# EAGLE design XephConnect_v0.1 (EAGLE 9.3.2)
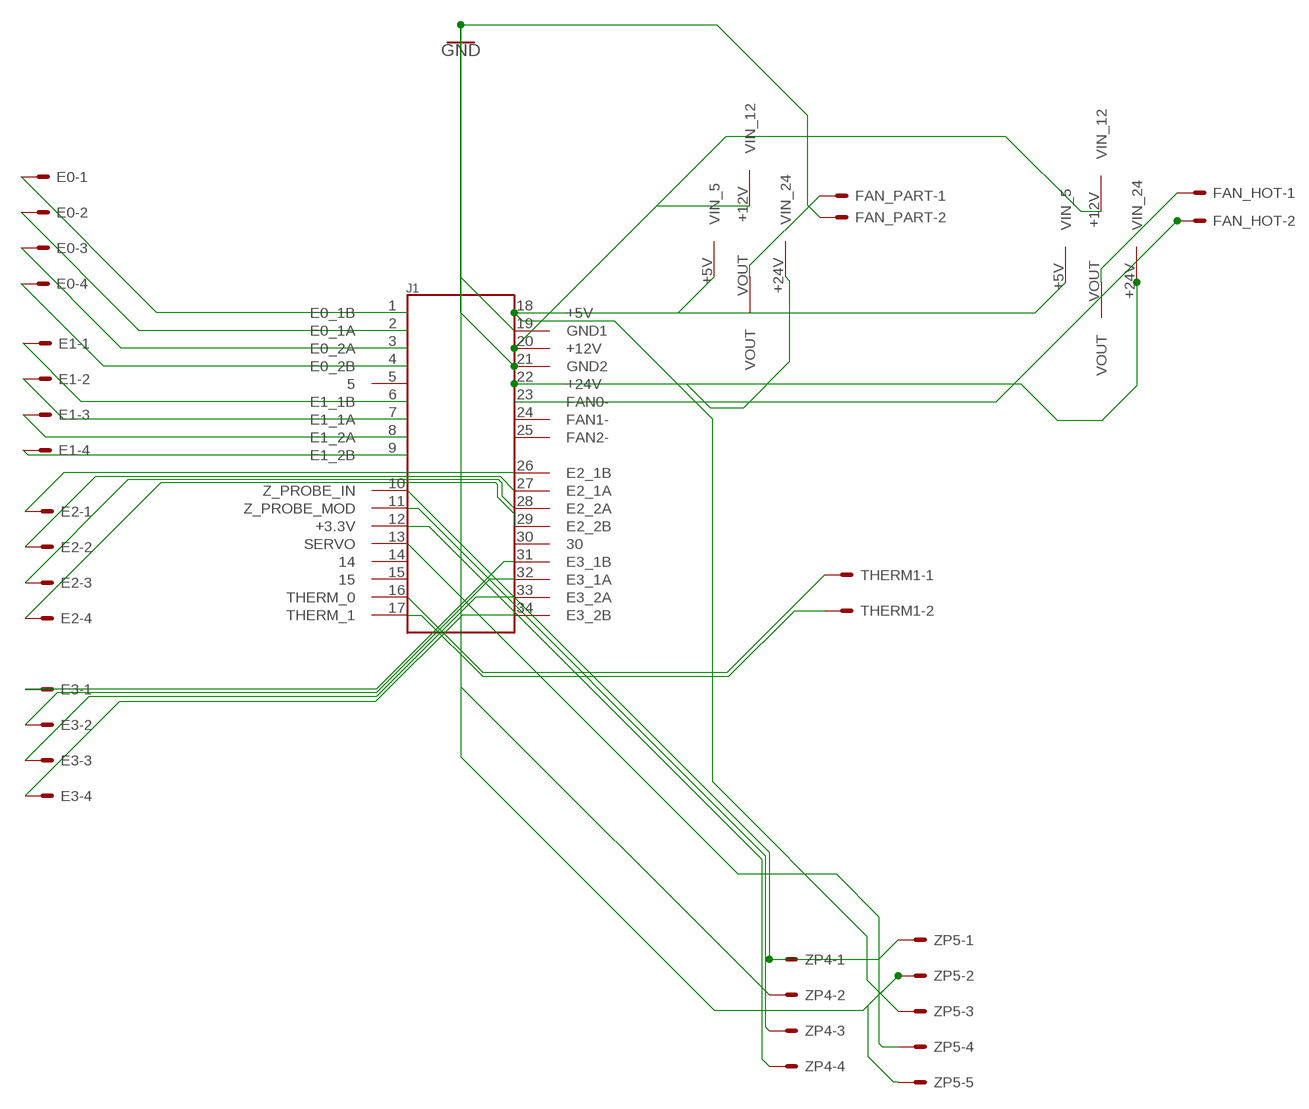
[diagram p0: schematic, sheet 1]

## Parts
E0  22-27-2041-04  [6410-04]
E1  22-27-2041-04  [6410-04]
E2  22-27-2041-04  [6410-04]
E3  22-27-2041-04  [6410-04]
FAN_HOT  22-27-2021-02  [6410-02]
FAN_PART  22-27-2021-02  [6410-02]
J1  6437288-1  [TE_6437288-1]
THERM1  22-27-2021-02  [6410-02]
U$1  CONN_03+01(T)  [1X03X01]
U$2  CONN_03+01(T)  [1X03X01]
ZP4  22-27-2041-04  [6410-04]
ZP5  22-27-2051-05  [6410-05]

## Nets
GND [ground]: FAN_PART.2 J1.19(GND1) J1.21(GND2) ZP4.2 ZP5.2 ZP5.5
N$1 [steppers]: E0.1 J1.1(E0_1B)
N$2 [steppers]: E0.2 J1.2(E0_1A)
N$3 [steppers]: E0.3 J1.3(E0_2A)
N$4 [steppers]: E0.4 J1.4(E0_2B)
N$5: J1.10(Z_PROBE_IN) ZP4.1 ZP5.1
N$6 [steppers]: E1.1 J1.6(E1_1B)
N$7 [steppers]: E1.2 J1.7(E1_1A)
N$8 [steppers]: E1.3 J1.8(E1_2A)
N$9 [steppers]: E1.4 J1.9(E1_2B)
N$10 [steppers]: E2.1 J1.26(E2_1B)
N$11 [steppers]: E2.2 J1.27(E2_1A)
N$12 [steppers]: E2.3 J1.28(E2_2A)
N$13 [steppers]: E2.4 J1.29(E2_2B)
N$14 [steppers]: E3.1 J1.31(E3_1B)
N$15 [steppers]: E3.2 J1.32(E3_1A)
N$16 [steppers]: E3.3 J1.33(E3_2A)
N$17 [steppers]: E3.4 J1.34(E3_2B)
N$18: J1.16(THERM_0) THERM1.1
N$19: J1.17(THERM_1) THERM1.2
N$20 [5v]: J1.18(+5V) U$1.+5V(VIN_5) U$2.+5V(VIN_5) ZP5.3
N$21 [12v]: J1.20(+12V) U$1.+12V(VIN_12) U$2.+12V(VIN_12)
N$22 [24v]: FAN_HOT.2 J1.23(FAN0-)
N$23 [24v]: J1.22(+24V) U$1.+24V(VIN_24) U$2.+24V(VIN_24)
N$24 [24v]: FAN_PART.1 U$1.VOUT
N$25 [24v]: FAN_HOT.1 U$2.VOUT
N$26: J1.11(Z_PROBE_MOD) ZP4.3
N$27 [3.3v]: J1.12(+3.3V) ZP4.4
N$28 [steppers]: J1.13(SERVO) ZP5.4
Unconnected: J1.5 J1.14 J1.15 J1.30

## Power pins joined to a net without a drawn wire
FAN1-: J1.24(FAN1-)
FAN2-: J1.25(FAN2-)

## Library data of the parts
E0 E1-E3 ZP4 = con-molex_EDITED:22-?-04: CONNECTOR wire to board 2.54 mm (.1 inch) pitch header; MF: MOLEX; OC_FARNELL: unknown; OC_NEWARK: unknown
FAN_HOT FAN_PART THERM1 = con-molex_EDITED:22-?-02: CONNECTOR wire to board 2.54 mm (.1 inch) pitch header; MF: MOLEX; OC_FARNELL: unknown; OC_NEWARK: unknown
J1 = 6437288-1:6437288-1: 34 Position 4 Row Right Angle Receptacle Through Hole Super Seal Cap Assy; COMMENT: 6437288-1; DESCRIPTION: 34 Position 4 Row Right Angle Receptacle Through Hole Super Seal Cap Assy; DIGI-KEY_PART_NUMBER: A124384-ND; DIGI-KEY_PURCHASE_URL: https://www.digikey.com/product-detail/en/te-connectivity-amp-connectors/6437288-1/A124384-ND/5428601?utm_source=snapeda&utm_medium=aggregator&utm_campaign=symbol; EU_ROHS_COMPLIANCE: Compliant; MF: TE Connectivity; MP: 6437288-1; PACKAGE: None; TE_PURCHASE_URL: https://www.te.com/usa-en/product-6437288-1.html?te_bu=Cor&te_type=disp&te_campaign=seda_glo_cor-seda-global-disp-prtnr-fy19-seda-model-bom-cta_sma-317_1&elqCampaignId=32493
U$1 U$2 = Xeph 3D Printing:CONN_03+01(T)
ZP5 = con-molex_EDITED:22-?-05: CONNECTOR wire to board 2.54 mm (.1 inch) pitch header; MF: MOLEX; OC_FARNELL: unknown; OC_NEWARK: unknown

## Net classes
1 steppers: width 0.4 mm, drill 0.4 mm
2 3.3v: width 0.4 mm, drill 0.4 mm, clearance 0.05 mm
3 5v: width 0.5 mm, drill 0.5 mm, clearance 0.06 mm
4 12v: width 0.6 mm, drill 0.6 mm, clearance 0.07 mm
5 24v: width 0.7 mm, drill 0.7 mm, clearance 0.08 mm
6 ground: width 0.7 mm, drill 0.7 mm

## Board
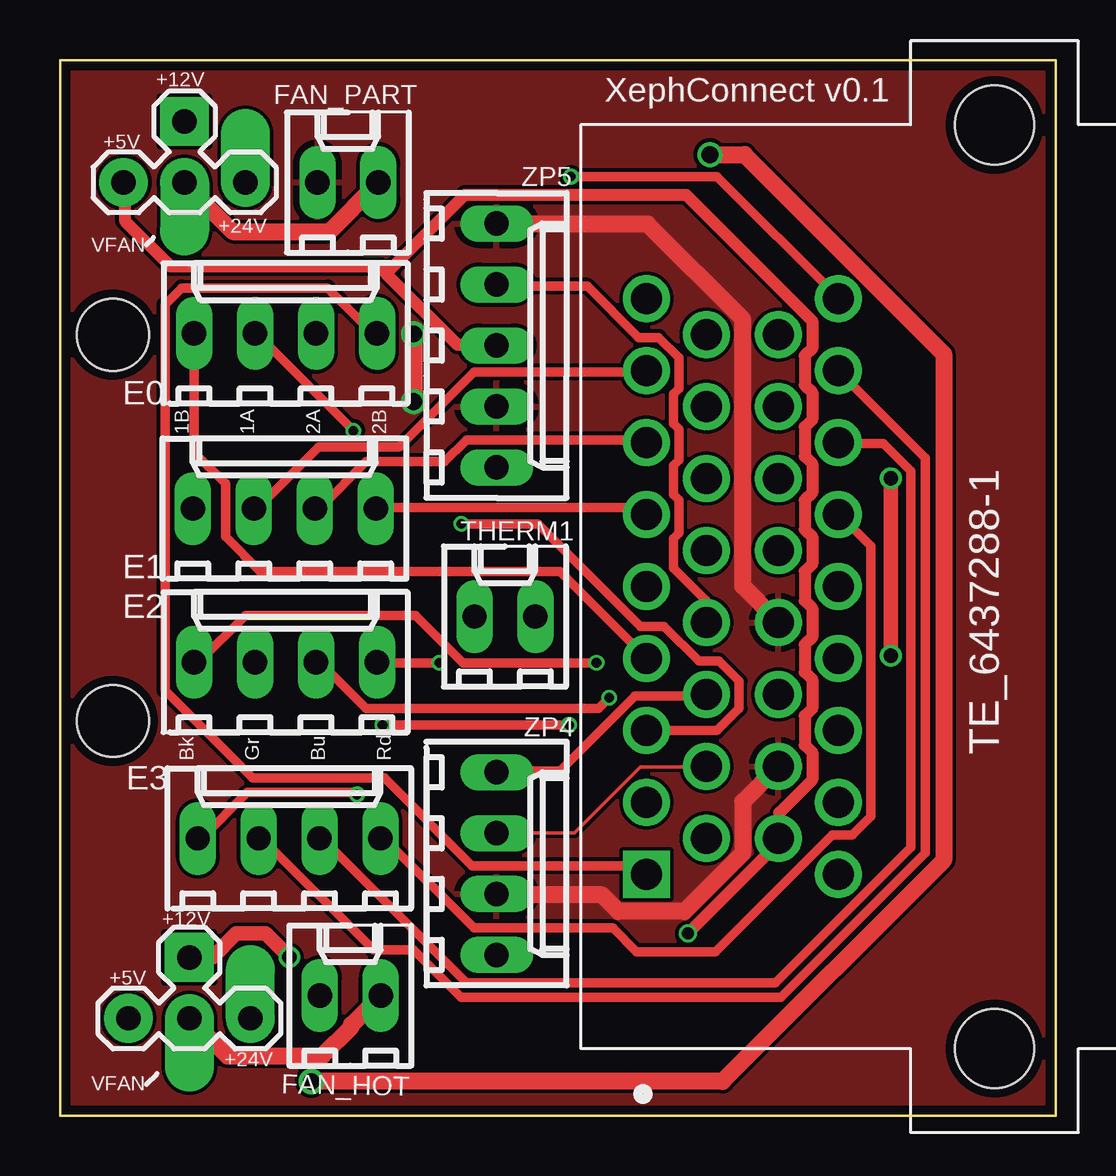
[diagram p1: board, top side]
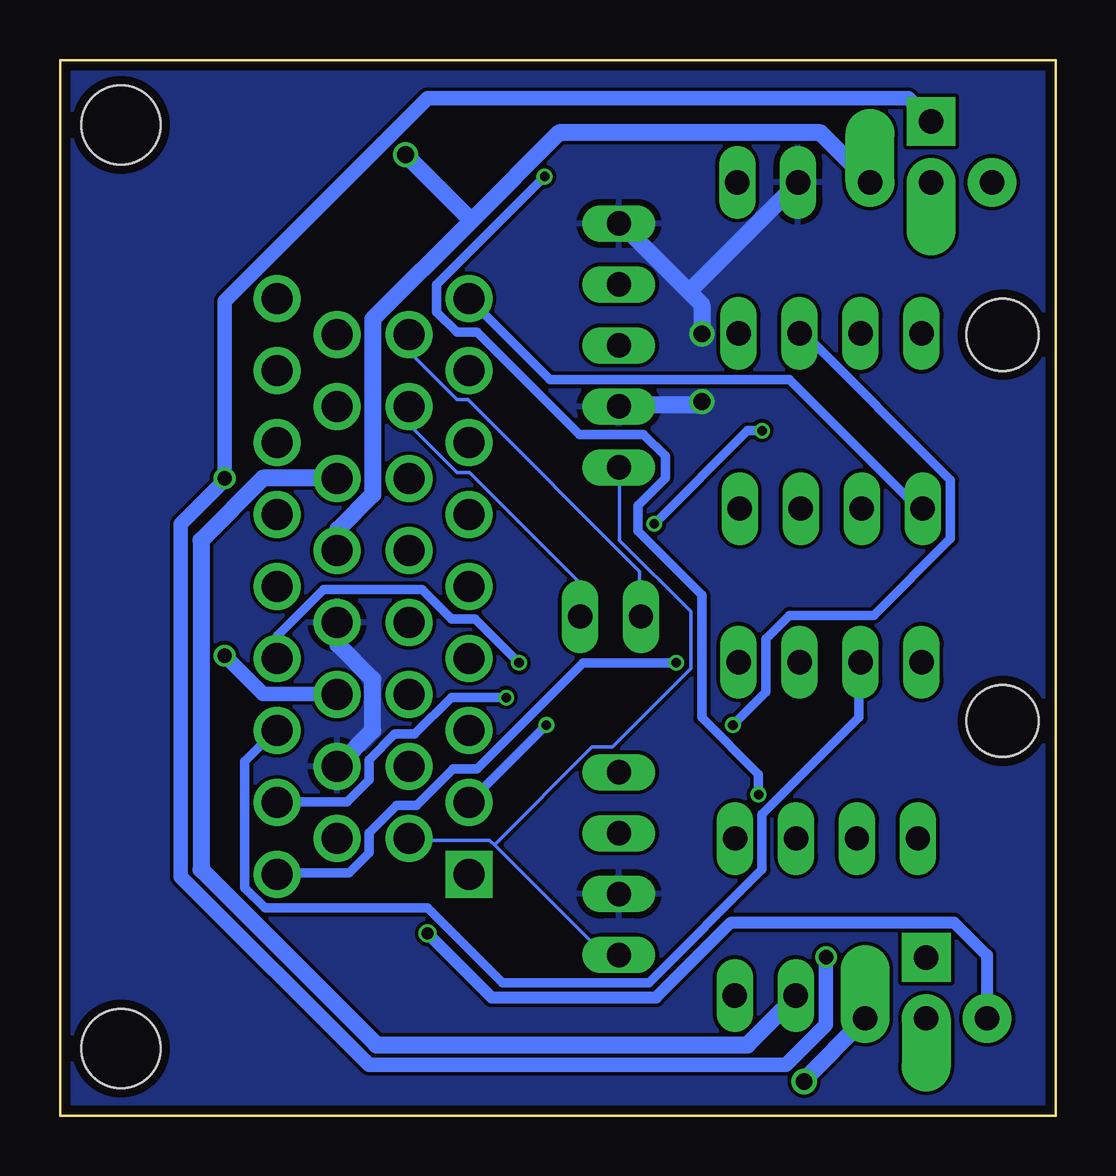
[diagram p2: board, bottom side, seen from below]

Size 41.5 x 44 mm. Coordinates in mm from the lower left corner, seen from the top.
Outline: 0,0 41.5,0 41.5,44 0,44 0,0
Copper layers (1*16): Top 0.035559375mm / dielectric 1.6mm / Bottom 0.035559375mm
Design rules "oshpark-2layer *": minimum track width 6mil, minimum drill 10mil, track to track 6mil, track to pad 6mil, pad to pad 6mil, via to via 6mil, smd to smd 6mil, copper to edge 15mil, drill to drill 6mil, minimum pad ring 5mil, minimum via ring 5mil, stop-mask expansion 2.5mil, vias tented up to drill 1mm, thermal gap 10mil
Holes 3 mm at 2.2,32.55 2.2,16.45

### Footprints (pad centres in the part's own frame; a part is rotated, then mirrored left to right if it is on the bottom)
6410-04 = drill 1.016 long: 1 3.81,0; 2 1.27,0; 3 -1.27,0; 4 -3.81,0
6410-02 = drill 1.016 long: 1 1.27,0; 2 -1.27,0
TE_6437288-1 = drill 1.3 square: 1 -12,4 | drill 1.3: 2 -9,4; 3 -6,4; 4 -3,4; 5 0,4; 6 3,4; 7 6,4; 8 9,4; 9 12,4; 10 -10.5,1.5; 11 -7.5,1.5; 12 -4.5,1.5; 13 -1.5,1.5; 14 1.5,1.5; 15 4.5,1.5; 16 7.5,1.5; 17 10.5,1.5; 18 -10.5,-1.5; 19 -7.5,-1.5; 20 -4.5,-1.5; 21 -1.5,-1.5; 22 1.5,-1.5; 23 4.5,-1.5; 24 7.5,-1.5; 25 10.5,-1.5; 26 -12,-4; 27 -9,-4; 28 -6,-4; 29 -3,-4; 30 0,-4; 31 3,-4; 32 6,-4; 33 9,-4; 34 12,-4 | hole 3.3: -19.25,-10.5; 19.25,-10.5
1X03X01 = drill 1.016 pad 2.032: +5V 0,0 | drill 1.016 pad 2.032 square: +12V 2.54,2.54 | drill 1.016 pad 2.032 offset: +24V 5.08,0; VOUT 2.54,0
6410-05 = drill 1.016 long: 1 5.08,0; 2 2.54,0; 3 0,0; 4 -2.54,0; 5 -5.08,0

### Placement (x,y rotation side)
E0  9.4,32.6 0 top
E1  9.35,25.3 0 top
E2  9.4,18.9 0 top
E3  9.55,11.55 0 top
FAN_HOT  12.1,5 0 top
FAN_PART  12,38.9 0 top
J1  28.45,22.05 90 top
THERM1  18.55,20.8 0 top
U$1  2.65,38.9 0 top
U$2  2.85,4.05 0 top
ZP4  18.2,10.5 270 top
ZP5  18.2,32.1 270 top

### Tracks (layer width: path | path; a pad name or v marks a point on that pad's centre or on a via)
GND  (via drill 0.7)
  Top 0.7: v14.75,32.59 v14.75,29.77 | ZP4.2 18.25,9.19 22.59,9.19 23.28,8.51 26.02,8.51 28.46,10.95 28.46,13.08 29.91,14.53 J1.19 | ZP5.5 18.25,37.16 24.5,37.16 28.46,33.2 28.46,22.07 29.91,20.62 J1.21
  Bottom 0.7: v14.75,29.77 14.9,29.61 18.17,29.61 ZP5.2 | v14.75,32.59 14.75,33.8 15.28,34.34 | 15.28,34.34 18.17,37.23 ZP5.5 | 15.28,34.34 10.78,38.83 FAN_PART.2 | J1.21 29.91,20.55 29.91,19.63 28.46,18.18 28.46,16.05 29.91,14.6 J1.19
  pour Top: 0.2,43.8 41.4,43.8 41.4,0.3 41.3,0.2 0.2,0.2
  pour Bottom: 0.2,43.8 41.4,43.8 41.4,0.3 41.3,0.2 0.2,0.2
N$1
  Top 0.4: E0.1 13.14,32.66 12.99,32.66 11.16,34.49 5.07,34.49 4.38,33.8 4.38,17.73 8.04,14.07 13.53,14.07 17.18,10.41 24.12,10.41 24.42,10.11 J1.1
N$2  (via drill 0.4)
  Top 0.4: v21.22,16.28 v13.45,16.28
  Bottom 0.4: v13.45,16.28 12.08,17.65 12.08,19.86 11.09,20.85 7.58,20.85 4.38,24.05 4.38,26.49 10.48,32.59 10.63,32.59 E0.2 | v21.22,16.28 24.42,13.08 J1.2
N$3  (via drill 0.4)
  Top 0.4: v12.23,28.55 8.19,32.59 E0.3 | v16.73,24.66 19.93,24.66 24.19,20.39 25.18,20.39 26.63,18.95 27.47,18.95 28.31,18.11 28.31,16.96 27.39,16.05 J1.3
  Bottom 0.4: v12.23,28.55 12.84,28.55 v16.73,24.66
N$4
  Top 0.4: E0.4 5.6,32.59 5.6,27.63 6.9,26.34 6.9,24.13 8.34,22.68 20.84,22.68 24.42,19.1 J1.4
N$5
  Bottom 0.152: 23.39,11.29 23.58,11.48 26.94,11.48 J1.10 | 23.39,11.29 18.86,6.75 18.25,6.75 ZP4.1 | 23.39,11.29 19.32,15.36 18.48,15.36 15.2,18.64 15.2,21 18.17,23.98 18.17,26.95 ZP5.1
N$6
  Top 0.4: E1.1 13.22,25.35 24.19,25.35 24.42,25.12 J1.6
N$7
  Top 0.4: E1.2 10.63,25.35 10.86,25.35 12.76,27.25 16.04,27.25 16.95,28.17 24.35,28.17 24.42,28.09 J1.7
N$8
  Top 0.4: E1.3 8.12,25.35 8.27,25.35 10.78,27.86 14.14,27.86 17.26,30.98 24.42,30.98 J1.8
N$9
  Bottom 0.4: E1.4 5.6,25.35 5.75,25.35 11.09,30.68 21.07,30.68 24.42,34.03 J1.9
N$10  (via drill 0.4)
  Top 0.4: v15.81,18.87 13.22,18.87 E2.1
  Bottom 0.4: v15.81,18.87 19.7,18.87 24.12,14.45 25.11,14.45 26.63,12.93 27.47,12.93 28.61,11.78 28.61,10.95 29.45,10.11 32.42,10.11 J1.26
N$11  (via drill 0.4)
  Top 0.4: v22.9,17.42 22.44,16.96 12.76,16.96 10.86,18.87 10.71,18.87 E2.2
  Bottom 0.4: v22.9,17.42 25.18,17.42 26.71,15.9 27.55,15.9 28.61,14.83 28.61,13.99 29.53,13.08 32.42,13.08 J1.27
N$12
  Bottom 0.4: E2.3 8.19,18.87 8.19,16.58 12.23,12.54 12.23,10.26 16.95,5.53 23.05,5.53 26.18,8.66 32.96,8.66 33.8,9.5 33.8,14.75 32.5,16.05 J1.28
N$13  (via drill 0.4)
  Top 0.4: v22.36,18.87 16.8,18.87 14.82,20.85 7.73,20.85 5.83,18.95 5.6,18.95 E2.4
  Bottom 0.4: v22.36,18.87 24.19,20.7 25.18,20.7 26.4,21.92 30.52,21.92 32.42,20.01 32.42,19.1 J1.29
N$14
  Top 0.4: E3.1 13.37,11.48 13.6,11.48 17.26,7.82 23.05,7.82 24.04,6.83 27.32,6.83 32.2,11.71 33.03,11.71 33.8,12.47 33.8,23.75 32.5,25.04 J1.31
N$15
  Top 0.4: E3.2 10.86,11.48 11.01,11.48 16.95,5.53 29.83,5.53 35.47,11.17 35.47,26.87 34.33,28.01 32.5,28.01 J1.32
N$16
  Top 0.4: E3.3 8.34,11.48 8.5,11.48 13.07,6.91 14.75,6.91 16.73,4.92 30.06,4.92 36.08,10.95 36.08,27.4 32.5,30.98 J1.33
N$17  (via drill 0.4)
  Top 0.4: v12.38,13.38 12.31,13.46 7.81,13.46 5.91,11.55 5.75,11.55 E3.4 | v21.3,39.14 27.39,39.14 32.42,34.11 J1.34
  Bottom 0.4: v12.38,13.38 12.38,14.22 14.75,16.58 14.75,21.69 17.41,24.36 17.41,25.42 16.27,26.57 16.27,27.48 17.18,28.39 19.85,28.39 24.12,32.66 24.96,32.66 25.79,33.5 25.79,34.64 v21.3,39.14
N$18
  Bottom 0.152: THERM1.1 19.85,20.85 19.85,22.22 24.42,26.79 24.96,26.79 26.94,28.77 26.94,29.54 J1.16
N$19
  Bottom 0.152: THERM1.2 17.34,20.85 17.34,22.68 24.5,29.84 24.96,29.84 26.94,31.82 26.94,32.51 J1.17
N$20  (via drill 0.5)
  Top 0.5: 13.6,35.1 13.3,35.41 4.61,35.41 2.71,37.31 2.71,38.83 U$1.+5V | 13.6,35.1 16.57,32.13 18.17,32.13 ZP5.3 | 13.6,35.1 16.88,38.38 26.1,38.38 31.36,33.12 31.36,31.98 31.05,31.67 31.05,30.45 31.36,30.15 31.36,29 31.05,28.7 31.05,27.48 31.36,27.18 31.36,25.96 31.05,25.65 31.05,24.43 31.36,24.13 31.36,22.98 31.05,22.68 31.05,21.46 31.36,21.16 31.36,19.94 31.05,19.63 31.05,18.49 31.36,18.18 31.36,16.96 31.05,16.66 31.05,15.44 31.36,15.14 31.36,13.99 29.98,12.62 29.98,11.55 J1.18 29.91,11.33 v26.18,7.59
  Bottom 0.5: v26.18,7.59 23.51,4.92 16.65,4.92 13.53,8.05 4.23,8.05 2.86,6.68 2.86,4.09 U$2.+5V
N$21  (via drill 0.6)
  Top 0.6: v34.63,26.57 v34.63,19.17 | v9.56,6.6 8.57,7.59 7.35,7.59 6.36,6.6 5.45,6.6 U$2.+12V
  Bottom 0.6: v34.63,19.17 33.03,17.57 29.98,17.57 J1.20 | U$1.+12V 5.22,41.5 6.13,42.41 26.18,42.41 34.63,33.96 v34.63,26.57 34.79,26.34 36.46,24.66 36.46,9.95 28.61,2.11 11.24,2.11 9.56,3.78 v9.56,6.6
N$22
  Bottom 0.7: FAN_HOT.2 10.86,4.92 12.84,2.94 28.31,2.94 35.62,10.26 35.62,23.98 33.03,26.57 29.98,26.57 J1.23
N$23  (via drill 0.7)
  Top 0.7: v10.48,1.42 27.62,1.42 36.84,10.64 36.84,31.75 28.54,40.05 v27.09,40.05
  Bottom 0.7: 24.35,37.31 20.69,40.97 9.79,40.97 U$1.+24V | 24.35,37.31 28.46,33.2 28.46,25.88 29.91,24.43 29.91,23.59 J1.22 | v10.48,1.42 10.48,1.5 7.96,4.01 U$2.+24V | 24.35,37.31 v27.09,40.05
N$24
  Top 0.7: FAN_PART.1 13.22,38.83 11.24,36.85 7.2,36.85 5.22,38.83 U$1.VOUT
N$25
  Top 0.7: FAN_HOT.1 13.3,4.92 12.15,3.78 12.15,3.71 10.94,2.49 6.97,2.49 5.45,4.01 U$2.VOUT
N$26
  Top 0.152: ZP4.3 18.25,11.78 21.45,11.78 24.19,14.53 26.94,14.53 J1.11
N$27
  Top 0.4: ZP4.4 18.25,14.37 20.84,14.37 23.96,17.5 26.94,17.5 J1.12
N$28
  Top 0.4: ZP5.4 18.25,34.57 21.98,34.57 24.12,32.43 24.96,32.43 25.79,31.59 25.79,30.3 25.57,30.07 25.57,28.85 25.79,28.62 25.79,27.33 25.57,27.1 25.57,25.88 25.79,25.65 25.79,24.28 25.57,24.05 25.57,22.83 26.94,21.46 26.94,20.62 J1.13

### Text on the board
tNames: +12V | XephConnect v0.1 | +5V | +24V | VFAN | 1B / / / 1A / / / 2A / / / 2B | Bk / / / Gr / / / Bu / / / Rd | TE_6437288-1 | +12V | +5V | +24V | VFAN